# Altium project FK723MK1_ZGT6_Large.PrjPCB
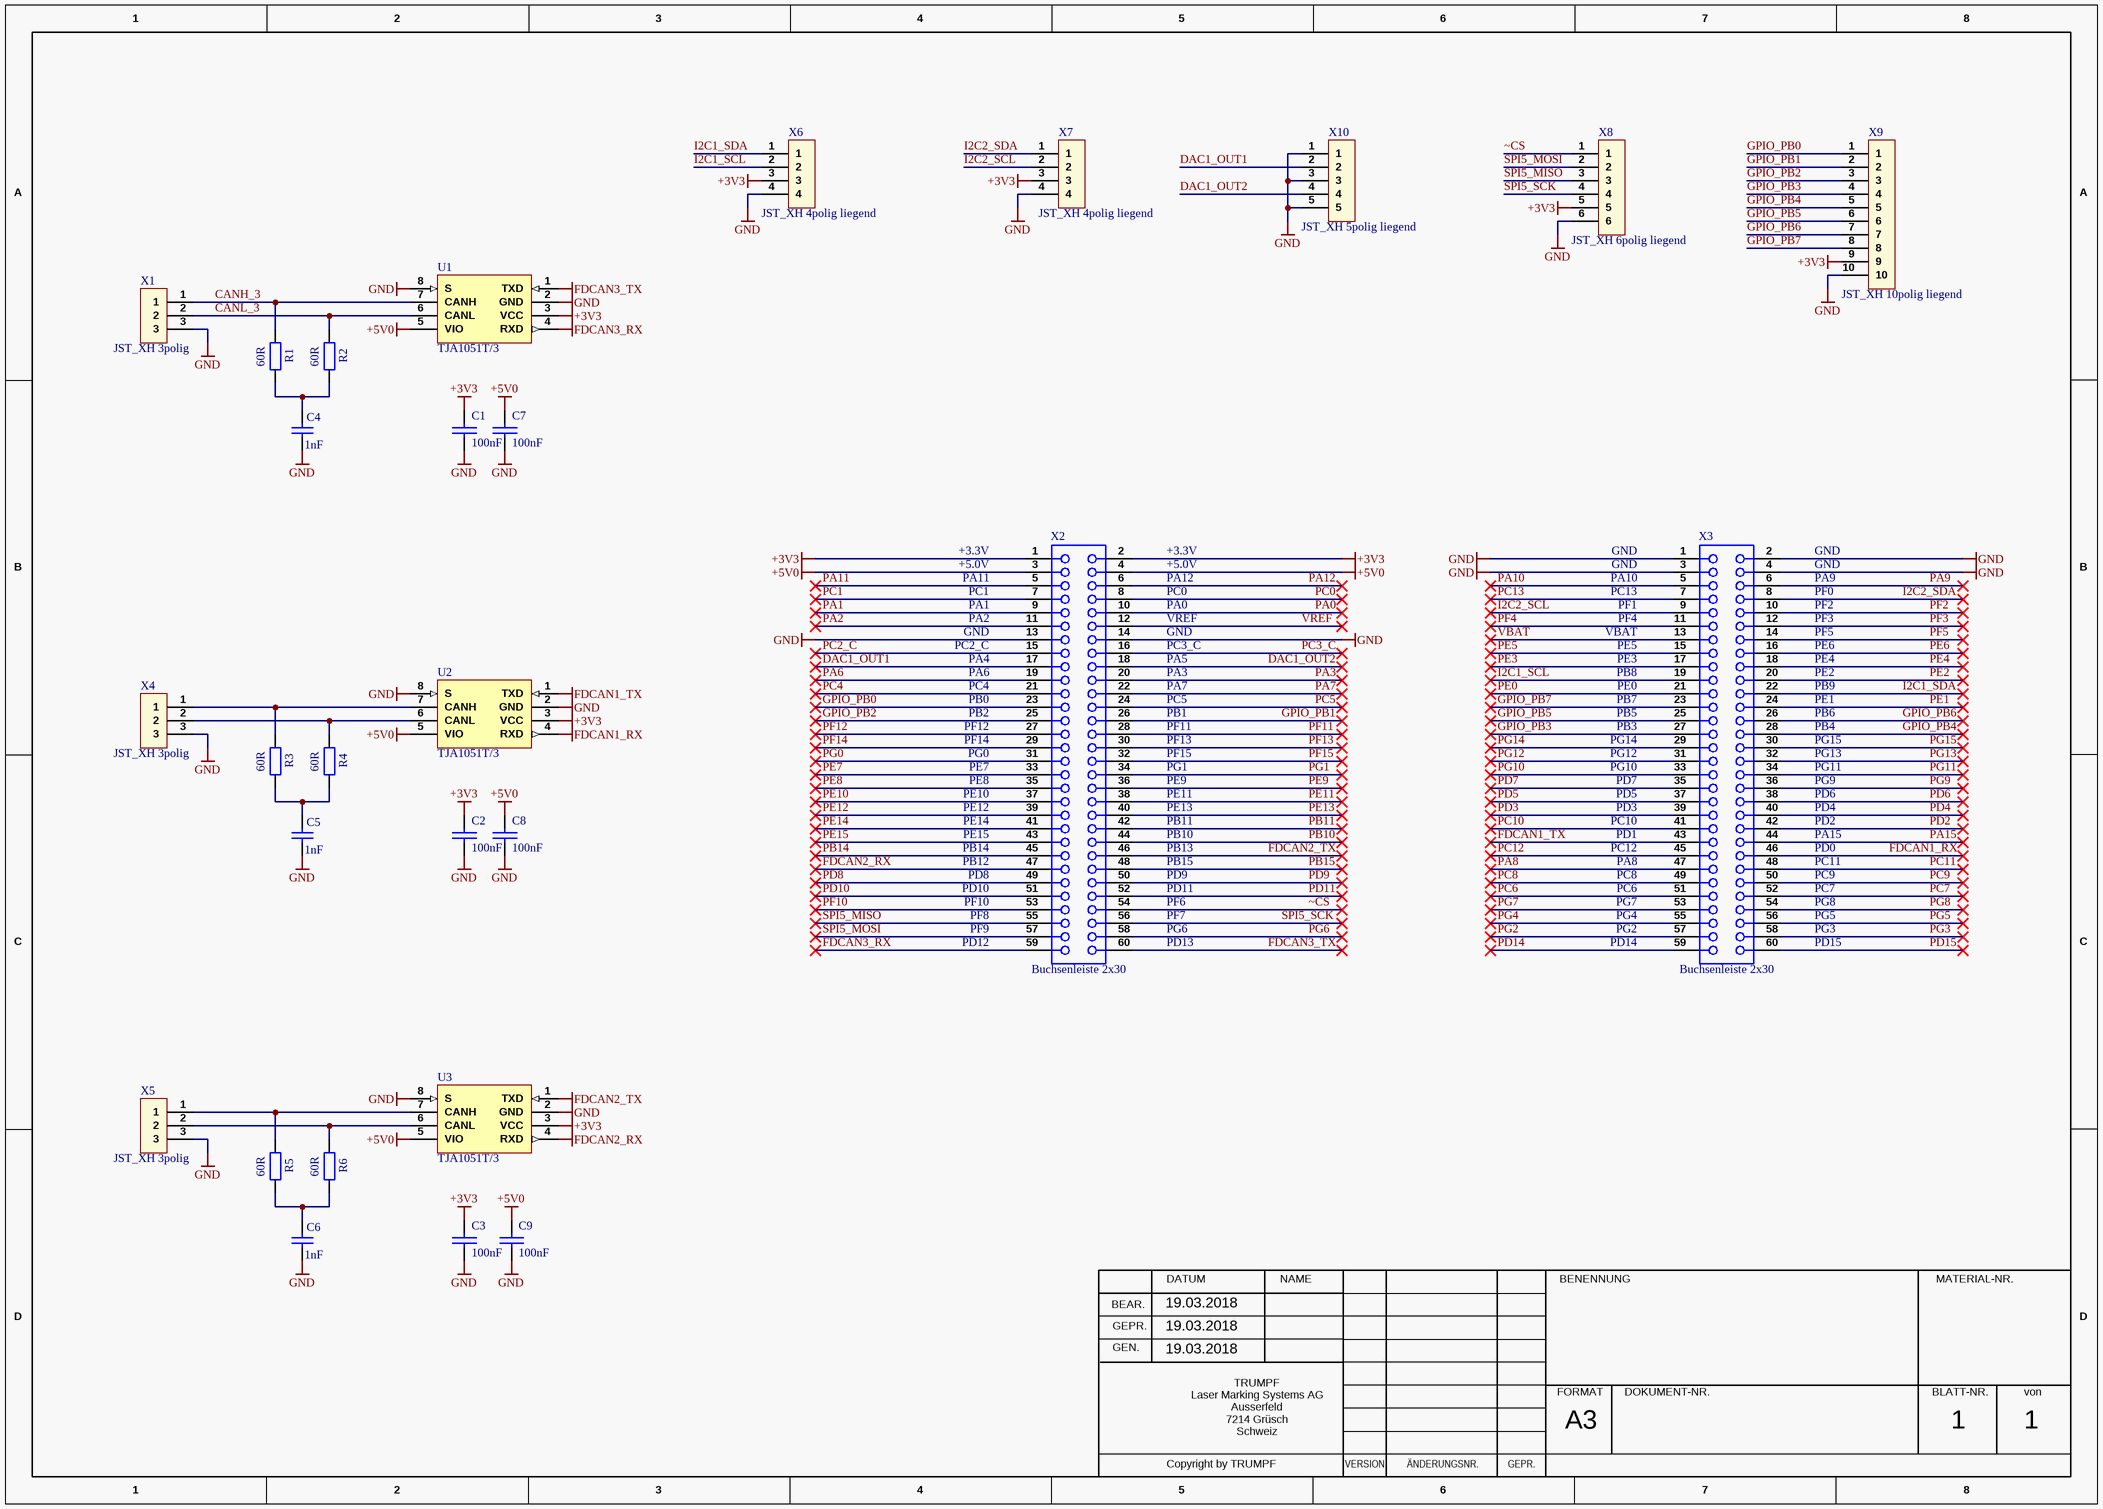
[diagram p0: FK723MK1_ZGT6_Large.SchDoc]
Autor: 513mk; BoardName: Laser Power Measurement 5; BoardNameAbkuerzung: LPM5; Date: 19.03.2018; DokumentenNr: 99018-0527; DokumentenNrBestueckungsplan: 99018-0527-BP; DokumentenNrLeiterplatte: 99018-0527-LP; DokumentenNrSchema: 99018-0527-SM; LeiterplattenNummer: 99018-0527-LP; SAP_Nr_Baugruppe: 2031588; SAP_Nr_Leiterplatte: 2375847
1 sheet, 28 parts. Net scope: global (net labels, ports and power ports of the same name join across sheets).
Board file: FK723MK1_ZGT6_Large.PcbDoc

## Sheet FK723MK1_ZGT6_Large.SchDoc: =SAP_Nr_Baugruppe
size A3; Organization: TRUMPF Laser Marking Systems AG; Address1: Trumpf Strasse 8; Address2: CH-7214 Grüsch; Address3: Laser Power Measurement 5; Address4: LPM5; DocumentNumber: 99018-0527-SM; Revision: 00; SheetNumber: 1; SheetTotal: 1; Date: 19.03.2018; ApprovedBy: 513mk; CheckedBy: 513mk; Author: 19.03.2018; DrawnBy: 513mk; SPICEModelCacheDGJBQTKQ: <root> / <DocumentId>DGJBQTKQ</DocumentId> / <CacheFrame Number="0"> / <Model Name="0603_885012006014_1nf" Kind="CKT"> / <Text>******* / .subckt 0603_885012006014_1nF 1 2 / Rser 1 3 0.0434067925003 / Lser 2 4 4.09321859E-10 / C1 3 4 0.000000001 / Rpar 3 4 10000000000 / .ends 0603_885012006014_1nF</Text> / </Model> / </CacheFrame> / </root>; Time: 19.03.2018

### Parts
C1  100nF  [0402]
C2  100nF  [0402]
C3  100nF  [0402]
C4  1nF  [WCAP-CSGP_0603_L1.6W0.8H0.8_Reflow]
C5  1nF  [WCAP-CSGP_0603_L1.6W0.8H0.8_Reflow]
C6  1nF  [WCAP-CSGP_0603_L1.6W0.8H0.8_Reflow]
C7  100nF  [0402]
C8  100nF  [0402]
C9  100nF  [0402]
R1  60R  [WRIS-KSKE_0805]
R2  60R  [WRIS-KSKE_0805]
R3  60R  [WRIS-KSKE_0805]
R4  60R  [WRIS-KSKE_0805]
R5  60R  [WRIS-KSKE_0805]
R6  60R  [WRIS-KSKE_0805]
U1  TJA1051T/3  [SO-8]
U2  TJA1051T/3  [SO-8]
U3  TJA1051T/3  [SO-8]
X1  JST_XH 3polig  [JST_XH 3polig, liegend]
X2  Buchsenleiste 2x30  [Buchsenleiste 2x30polig]
X3  Buchsenleiste 2x30  [Buchsenleiste 2x30polig]
X4  JST_XH 3polig  [JST_XH 3polig, liegend]
X5  JST_XH 3polig  [JST_XH 3polig, liegend]
X6  JST_XH 4polig liegend  [JST_XH 4polig, liegend]
X7  JST_XH 4polig liegend  [JST_XH 4polig, liegend]
X8  JST_XH 6polig liegend  [JST_XH 6polig, liegend]
X9  JST_XH 10polig liegend  [JST_XH 10polig, liegend]
X10  JST_XH 5polig liegend  [JST_XH 5polig, liegend]

### Nets
+3V3: C1.1 C2.1 C3.1 U1.3(VCC) U2.3(VCC) U3.3(VCC) X2.1 X2.2 X6.3 X7.3 X8.5 X9.9
+5V0: C7.1 C8.1 C9.1 U1.5(VIO) U2.5(VIO) U3.5(VIO) X2.3 X2.4
FDCAN1_RX: U2.4(RXD) X3.46
FDCAN1_TX: U2.1(TXD) X3.43
FDCAN2_RX: U3.4(RXD) X2.47
FDCAN2_TX: U3.1(TXD) X2.46
FDCAN3_RX: U1.4(RXD) X2.59
FDCAN3_TX: U1.1(TXD) X2.60
GND: C1.2 C2.2 C3.2 C4.1 C5.1 C6.1 C7.2 C8.2 C9.2 U1.2(GND) U1.8(S) U2.2(GND) U2.8(S) U3.2(GND) U3.8(S) X1.3 X2.13 X2.14 X3.1 X3.2 X3.3 X3.4 X4.3 X5.3 X6.4 X7.4 X8.6 X9.10 X10.1 X10.3 X10.5
CANH_3: R1.2 U1.7(CANH) X1.1
CANL_3: R2.2 U1.6(CANL) X1.2
DAC1_OUT1: X2.17 X10.2
DAC1_OUT2: X2.18 X10.4
GPIO_PB0: X2.23 X9.1
GPIO_PB1: X2.26 X9.2
GPIO_PB2: X2.25 X9.3
GPIO_PB3: X3.27 X9.4
GPIO_PB4: X3.28 X9.5
GPIO_PB5: X3.25 X9.6
GPIO_PB6: X3.26 X9.7
GPIO_PB7: X3.23 X9.8
I2C1_SCL: X3.19 X6.2
I2C1_SDA: X3.22 X6.1
I2C2_SCL: X3.9 X7.2
I2C2_SDA: X3.8 X7.1
PA0: X2.10
PA1: X2.9
PA2: X2.11
PA3: X2.20
PA6: X2.19
PA7: X2.22
PA8: X3.47
PA9: X3.6
PA10: X3.5
PA11: X2.5
PA12: X2.6
PA15: X3.44
PB10: X2.44
PB11: X2.42
PB14: X2.45
PB15: X2.48
PC0: X2.8
PC1: X2.7
PC2_C: X2.15
PC3_C: X2.16
PC4: X2.21
PC5: X2.24
PC6: X3.51
PC7: X3.52
PC8: X3.49
PC9: X3.50
PC10: X3.41
PC11: X3.48
PC12: X3.45
PC13: X3.7
PD2: X3.42
PD3: X3.39
PD4: X3.40
PD5: X3.37
PD6: X3.38
PD7: X3.35
PD8: X2.49
PD9: X2.50
PD10: X2.51
PD11: X2.52
PD14: X3.59
PD15: X3.60
PE0: X3.21
PE1: X3.24
PE2: X3.20
PE3: X3.17
PE4: X3.18
PE5: X3.15
PE6: X3.16
PE7: X2.33
PE8: X2.35
PE9: X2.36
PE10: X2.37
PE11: X2.38
PE12: X2.39
PE13: X2.40
PE14: X2.41
PE15: X2.43
PF2: X3.10
PF3: X3.12
PF4: X3.11
PF5: X3.14
PF10: X2.53
PF11: X2.28
PF12: X2.27
PF13: X2.30
PF14: X2.29
PF15: X2.32
PG0: X2.31
PG1: X2.34
PG2: X3.57
PG3: X3.58
PG4: X3.55
PG5: X3.56
PG6: X2.58
PG7: X3.53
PG8: X3.54
PG9: X3.36
PG10: X3.33
PG11: X3.34
PG12: X3.31
PG13: X3.32
PG14: X3.29
PG15: X3.30
SPI5_MISO: X2.55 X8.3
SPI5_MOSI: X2.57 X8.2
SPI5_SCK: X2.56 X8.4
VBAT: X3.13
VREF: X2.12
~CS: X2.54 X8.1
NetC4_2: C4.2 R1.1 R2.1
NetC5_2: C5.2 R3.1 R4.1
NetC6_2: C6.2 R5.1 R6.1
NetR3_2: R3.2 U2.7(CANH) X4.1
NetR4_2: R4.2 U2.6(CANL) X4.2
NetR5_2: R5.2 U3.7(CANH) X5.1
NetR6_2: R6.2 U3.6(CANL) X5.2

### Notes on the sheet
- PA11
- +3.3V
- +5.0V
- PA12
- PA10
- GND
- PA9
- PC1
- PA1
- PA2
- PC2_C
- PC0
- PA0
- VREF
- PC3_C
- PC13
- PF1
- PF4
- VBAT
- PE5
- PF0
- PF2
- PF3
- PF5
- PE6
- PA4
- PA6
- PC4
- PB0
- PB2
- PA5
- PA3
- PA7
- PC5
- PB1
- PE3
- PB8
- PE0
- PB7
- PB5
- PE4
- PE2
- PB9
- PE1
- PB6
- PF12
- PF14
- PG0
- PE7
- PE8
- PF11
- PF13
- PF15
- PG1
- PE9
- PB3
- PG14
- PG12
- PG10
- PD7
- PB4
- PG15
- PG13
- PG11
- PG9
- PE10
- PE12
- PE14
- PE15
- PB14
- PE11
- PE13
- PB11
- PB10
- PB13
- PD5
- PD3
- PC10
- PD1
- PC12
- PD6
- PD4
- PD2
- PA15
- PD0
- PB12
- PD8
- PD10
- PF10
- PF8
- PB15
- PD9
- PD11
- PF6
- PF7
- PA8
- PC8
- PC6
- PG7
- PG4
- PC11
- PC9
- PC7
- PG8
- PG5
- PF9
- PD12
- PG6
- PD13
- PG2
- PD14
- PG3
- PD15
- BEAR.
- GEPR.
- DATUM
- NAME
- BENENNUNG
- MATERIAL-NR.
- GEN.
- FORMAT
- DOKUMENT-NR.
- BLATT-NR.
- von
- TRUMPF
  Laser Marking Systems AG
  Ausserfeld
  7214 Grüsch
  Schweiz
- A3
- Copyright by TRUMPF
- VERSION
- ÄNDERUNGSNR.

### Library data of the parts
C1-C3 C7-C9 = 100nF: 100nF 16V 10% 0402; Trumpf Nr.: 1606554
C4-C6 = 885012006014: WCAP-CSGP Multilayer Ceramic Chip Capacitor, General Purpose, size 0603, 1nF, 10V; Manufacturer: Wurth Elektronik; Case/Size Code: 0603; Capacitance Tolerance: +/-5%; Ceramic Type: NP0; Insulation Resistance: 10GΩ; Q Factor: 1000; Technical Reference: NP00603102J010DFCT10000; Manufacturer Part Number: 885012006014; Category: Multilayer Ceramic Chip Capacitors; Match Code: WCAP-CSGP; ComponentLink1Description: Website Link; ComponentLink1URL: https://www.we-online.com/redexpert/article/885012006014?ad; ComponentLink2Description: Datasheet Link; ComponentLink2URL: https://www.we-online.com/redexpert/spec/885012006014?ad; Mount: Surface Mount; Min Operating Temperature: -55°C; Max Operating Temperature: 125°C; Packaging: Tape and Reel; Length: 1.6mm; Width: 0.8mm; Height: 0.8mm; Capacitance: 1nF; Rated Voltage (DC): 10V
R1-R6 = 560050320001: WRIS-KSKE Thick Film Resistor, SMT, size 0805, 0.1Ω, 0.33W, +/-1%; Manufacturer: Wurth Elektronik; Case/Size Code: 0805; Rated Current: 1.81A; Temperature Coefficient of Resistance Max: 250ppm/°C; Manufacturer Part Number: 560050320001; Category: Thick Film Resistors; Match Code: WRIS-KSKE; ComponentLink1Description: Website Link; ComponentLink1URL: https://www.we-online.com/redexpert/article/560050320001?ad; ComponentLink2Description: Datasheet Link; ComponentLink2URL: https://www.we-online.com/redexpert/spec/560050320001?ad; Mount: Surface Mount; Min Operating Temperature: -55°C; Max Operating Temperature: 155°C; Packaging: Tape and Reel; Length: 2mm; Width: 1.25mm; Height: 0.6mm; Rated Power: 0.33W; Resistance: 0.1Ω; Resistance Tolerance: +/-1%
X6 X7 = JST_XH 4polig
X8 = JST_XH 6polig
X9 = JST_XH 10polig
X10 = JST_XH 5polig